# EAGLE design 7G_controller (EAGLE 6.4)
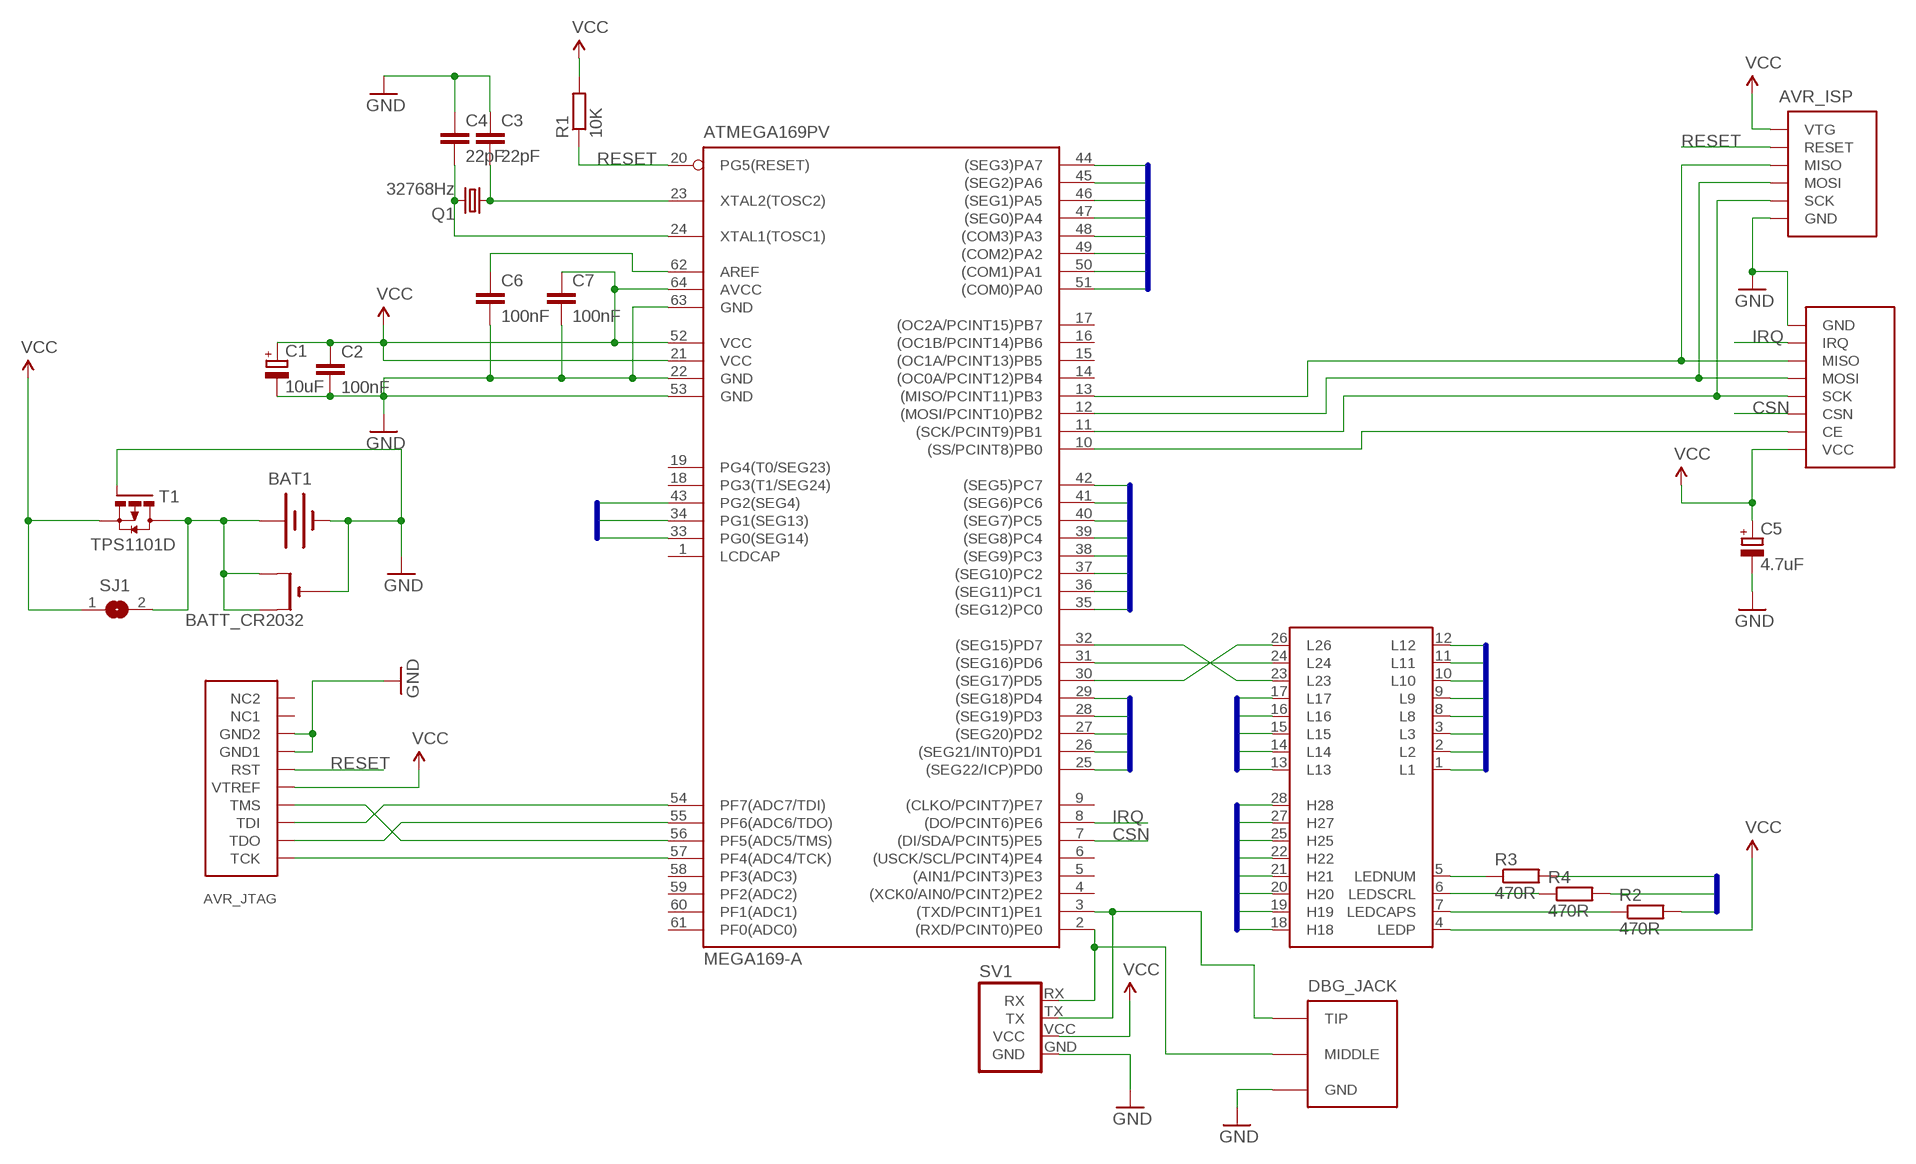
[diagram p0: schematic, sheet 1]

## Parts
ATMEGA169PV  MEGA169-A  [TQFP64]
AVR_ISP  AVR-ISP-6SMALL_FP  [AVR-ISP-6-SMALL-FP]
AVR_JTAG  AVR-JTAG  [AVR-JTAG]
BAT1  BATTERYPLAIN  [BATTERY]
BATT_CR2032  CR2032SMT  [CR2032-SMD]
C1  10uF  CPOL-EUSMCB  [SMC_B]
C2  100nF  C-EUC0805  [C0805]
C3  22pF  C-EUC0805  [C0805]
C4  22pF  C-EUC0805  [C0805]
C5  4.7uF  CPOL-EUSMCB  [SMC_B]
C6  100nF  C-EUC0805  [C0805]
C7  100nF  C-EUC0805  [C0805]
DBG_JACK  JACK_FEMALE_3.5MMCHEAP  [JACK_CHEAP]
MTRX_CONN  SS7G_CONNSMD  [SS7G_CONN_SMD]
NRF24L01  NRF24L01_MOD_NINE_EAGLESGENERIC  [NRF24L01_MOD_GENERIC]
Q1  32768Hz  CRYSTAL  [NSK_QUARTZ_CLOCK]
R1  10K  R-EU_R0805  [R0805]
R2  470R  R-EU_R0805  [R0805]
R3  470R  R-EU_R0805  [R0805]
R4  470R  R-EU_R0805  [R0805]
SJ1  SJ  [SJ]
SV1  UART_PORT  [UART_PORT]
T1  TPS1101D  [SO8]

## Nets
AREF: ATMEGA169PV.62(AREF) C6.1
CAPS: ATMEGA169PV.43(PG2(SEG4)) R2.2
CE: ATMEGA169PV.10((SS/PCINT8)PB0) NRF24L01.CE
CSN: ATMEGA169PV.7((DI/SDA/PCINT5)PE5) NRF24L01.CSN
GND: ATMEGA169PV.22(GND) ATMEGA169PV.53(GND) ATMEGA169PV.63(GND) AVR_ISP.GND AVR_JTAG.P$2(GND1) AVR_JTAG.P$10(GND2) BAT1.- BATT_CR2032.- C1.- C2.2 C3.1 C4.1 C5.- C6.2 C7.2 DBG_JACK.1(GND) NRF24L01.GND SV1.GND T1.4(G)
H18: ATMEGA169PV.42((SEG5)PC7) MTRX_CONN.18(H18)
H19: ATMEGA169PV.41((SEG6)PC6) MTRX_CONN.19(H19)
H20: ATMEGA169PV.40((SEG7)PC5) MTRX_CONN.20(H20)
H21: ATMEGA169PV.38((SEG9)PC3) MTRX_CONN.21(H21)
H22: ATMEGA169PV.36((SEG11)PC1) MTRX_CONN.22(H22)
H25: ATMEGA169PV.35((SEG12)PC0) MTRX_CONN.25(H25)
H27: ATMEGA169PV.37((SEG10)PC2) MTRX_CONN.27(H27)
H28: ATMEGA169PV.39((SEG8)PC4) MTRX_CONN.28(H28)
IRQ: ATMEGA169PV.8((DO/PCINT6)PE6) NRF24L01.IRQ
L1: ATMEGA169PV.50((COM1)PA1) MTRX_CONN.1(L1)
L2: ATMEGA169PV.48((COM3)PA3) MTRX_CONN.2(L2)
L3: ATMEGA169PV.46((SEG1)PA5) MTRX_CONN.3(L3)
L8: ATMEGA169PV.45((SEG2)PA6) MTRX_CONN.8(L8)
L9: ATMEGA169PV.44((SEG3)PA7) MTRX_CONN.9(L9)
L10: ATMEGA169PV.25((SEG22/ICP)PD0) MTRX_CONN.10(L10)
L11: ATMEGA169PV.26((SEG21/INT0)PD1) MTRX_CONN.11(L11)
L12: ATMEGA169PV.27((SEG20)PD2) MTRX_CONN.12(L12)
L13: ATMEGA169PV.28((SEG19)PD3) MTRX_CONN.13(L13)
L14: ATMEGA169PV.29((SEG18)PD4) MTRX_CONN.14(L14)
L15: ATMEGA169PV.51((COM0)PA0) MTRX_CONN.15(L15)
L16: ATMEGA169PV.49((COM2)PA2) MTRX_CONN.16(L16)
L17: ATMEGA169PV.47((SEG0)PA4) MTRX_CONN.17(L17)
LEDCAPS: MTRX_CONN.7(LEDCAPS) R2.1
LEDNUM: MTRX_CONN.6(LEDSCRL) R4.1
LEDSCRL: MTRX_CONN.5(LEDNUM) R3.1
MISO: ATMEGA169PV.13((MISO/PCINT11)PB3) AVR_ISP.MISO NRF24L01.MISO
MOSI: ATMEGA169PV.12((MOSI/PCINT10)PB2) AVR_ISP.MOSI NRF24L01.MOSI
N$2: ATMEGA169PV.32((SEG15)PD7) MTRX_CONN.23(L23)
N$4: BAT1.+ BATT_CR2032.+$1(+) BATT_CR2032.+$2(+1) SJ1.2 T1.5(D) T1.6(D) T1.7(D) T1.8(D)
N$6: ATMEGA169PV.23(XTAL2(TOSC2)) C3.2 Q1.1
N$8: ATMEGA169PV.24(XTAL1(TOSC1)) C4.2 Q1.4
N$20: ATMEGA169PV.30((SEG17)PD5) MTRX_CONN.26(L26)
N$21: ATMEGA169PV.31((SEG16)PD6) MTRX_CONN.24(L24)
N$29: ATMEGA169PV.2((RXD/PCINT0)PE0) DBG_JACK.4(MIDDLE) SV1.RX
N$30: ATMEGA169PV.3((TXD/PCINT1)PE1) DBG_JACK.2(TIP) DBG_JACK.3(TIP) SV1.TX
NUML: ATMEGA169PV.33(PG0(SEG14)) R3.2
RESET: ATMEGA169PV.20(PG5(RESET)) AVR_ISP.RESET AVR_JTAG.P$6(RST) R1.1
SCK: ATMEGA169PV.11((SCK/PCINT9)PB1) AVR_ISP.SCK NRF24L01.SCK
SCRL: ATMEGA169PV.34(PG1(SEG13)) R4.2
TCK: ATMEGA169PV.57(PF4(ADC4/TCK)) AVR_JTAG.P$1(TCK)
TDI: ATMEGA169PV.54(PF7(ADC7/TDI)) AVR_JTAG.P$9(TDI)
TDO: ATMEGA169PV.55(PF6(ADC6/TDO)) AVR_JTAG.P$3(TDO)
TMS: ATMEGA169PV.56(PF5(ADC5/TMS)) AVR_JTAG.P$5(TMS)
VCC: ATMEGA169PV.21(VCC) ATMEGA169PV.52(VCC) ATMEGA169PV.64(AVCC) AVR_ISP.VCC(VTG) AVR_JTAG.P$4(VTREF) C1.+ C2.1 C5.+ C7.1 MTRX_CONN.4(LEDP) NRF24L01.+3.3V(VCC) R1.2 SJ1.1 SV1.VCC T1.1(S) T1.2(S) T1.3(S)
Unconnected: ATMEGA169PV.1(LCDCAP) ATMEGA169PV.4((XCK0/AIN0/PCINT2)PE2) ATMEGA169PV.5((AIN1/PCINT3)PE3) ATMEGA169PV.6((USCK/SCL/PCINT4)PE4) ATMEGA169PV.9((CLKO/PCINT7)PE7) ATMEGA169PV.14((OC0A/PCINT12)PB4) ATMEGA169PV.15((OC1A/PCINT13)PB5) ATMEGA169PV.16((OC1B/PCINT14)PB6) ATMEGA169PV.17((OC2A/PCINT15)PB7) ATMEGA169PV.18(PG3(T1/SEG24)) ATMEGA169PV.19(PG4(T0/SEG23)) ATMEGA169PV.58(PF3(ADC3)) ATMEGA169PV.59(PF2(ADC2)) ATMEGA169PV.60(PF1(ADC1)) ATMEGA169PV.61(PF0(ADC0)) AVR_JTAG.P$7(NC1) AVR_JTAG.P$8(NC2)

## Buses
H28,H27,H25,H22,H21,H20,H19,H18
L1,L2,L3,L8,L9,L10,L11,L12,L13,L14,L15,L16,L17,L23,L24,L26
NUML,SCRL,CAPS

## Library data of the parts
ATMEGA169PV = KileParts:MEGA169: MICROCONTROLLER 16 Kbytes FLASH 1 Kbytes SRAM 512 bytes EEPROM USART 8-channel 10 bit ADC 4x25 Segment LCD Driver Source: avr.lbr; MPN: ATMEGA169PV-8AU; OC_FARNELL: 1617046; OC_NEWARK: 03P4011
AVR_ISP = KileParts:AVR-ISP-6: AVR ISP-6 Serial Programming Header
AVR_JTAG = KileParts:AVR-JTAG
BAT1 = KileParts:BATTERY: Battery Holders Various common sizes : AA, AAA, 20mm coin cell and 12mm coin cell.
BATT_CR2032 = KileParts:CR2032
C1 C5 = rcl:CPOL-EU: POLARIZED CAPACITOR, European symbol
C2-C4 C6 C7 = rcl:C-EU: CAPACITOR, European symbol
DBG_JACK = KileParts:JACK_FEMALE_3.5MM
MTRX_CONN = KileParts:SS7G_CONN: Connector for Steelseries 7G keyboard controller.
NRF24L01 = KileParts:NRF24L01_MOD_NINE_EAGLES
Q1 = KileParts:CRYSTAL: CRYSTAL
R1-R4 = rcl:R-EU_: RESISTOR, European symbol
SJ1 = jumper:SJ: SMD solder JUMPER
SV1 = KileParts:UART_PORT: PIN HEADER; OC_FARNELL: unknown; OC_NEWARK: unknown
T1 = KileParts:TPS1101D

## Board
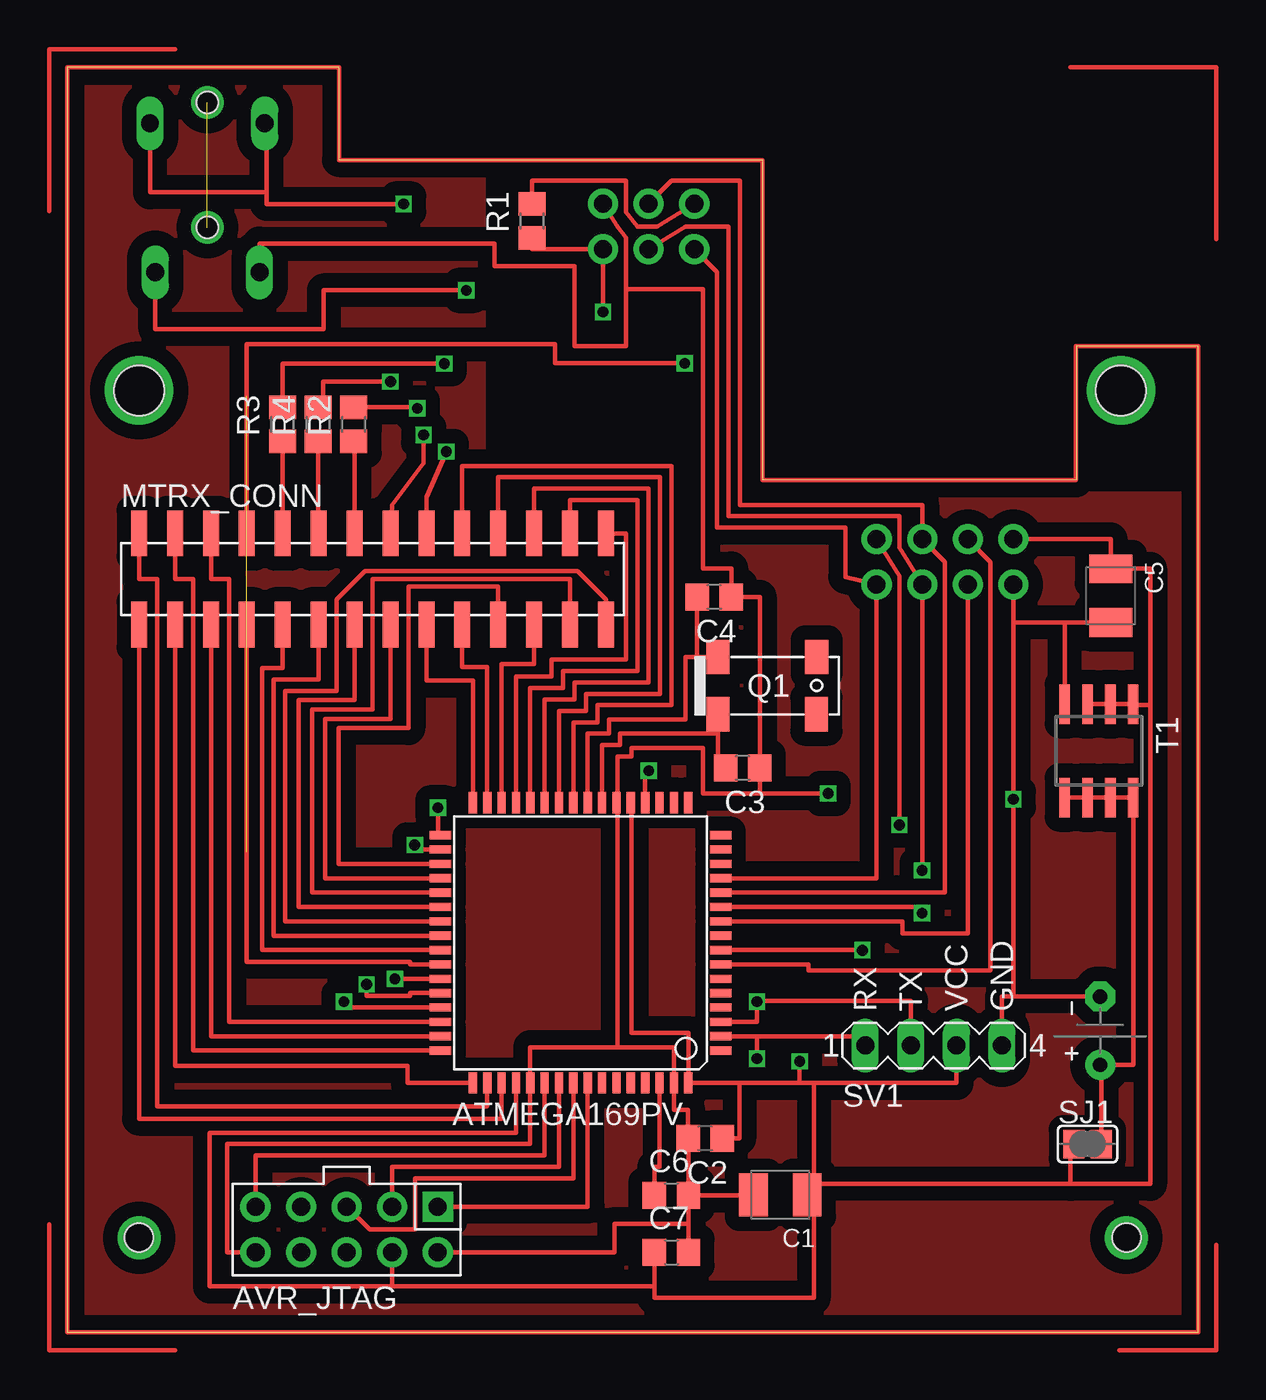
[diagram p1: board, top side]
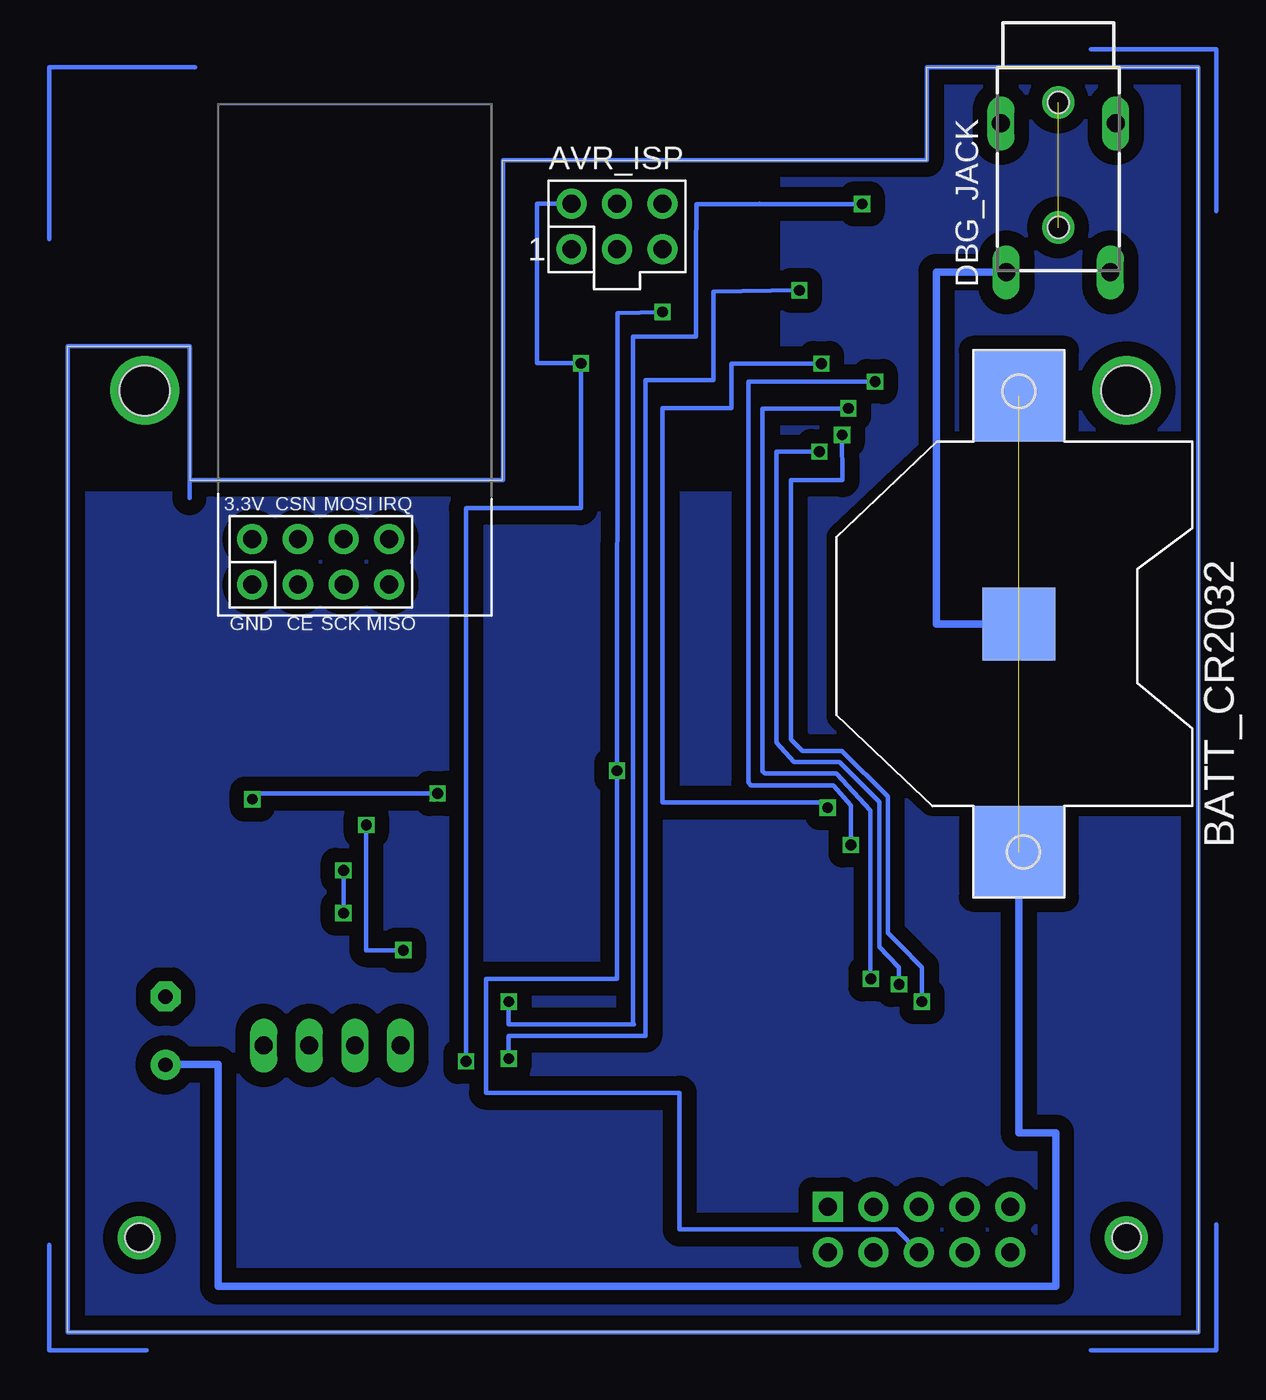
[diagram p2: board, bottom side, seen from below]

Size 63 x 70.46 mm. Coordinates in mm from the lower left corner, seen from the top.
Outline: 0,0 63,0 63,54.93 56.2,54.93 56.2,47.46 38.75,47.46 38.75,65.3 15.13,65.3 15.13,70.46 0,70.46 0,0
Copper layers (1*16): Top 0.035mm / dielectric 1.5mm / Bottom 0.035mm
Design rules "ITEADstudio_DRC": minimum track width 6mil, minimum drill 12mil, track to track 6mil, track to pad 6mil, pad to pad 6mil, via to via 6mil, smd to smd 0mil, copper to edge 10mil, drill to drill 10mil, minimum pad ring 10mil, minimum via ring 6mil, stop-mask expansion 2mil, vias tented up to drill 100mil, thermal gap 10mil
Holes 1.6 mm at 4,5.26 59,5.26
Holes 2.8 mm at 4,52.46 58.7,52.46

### Footprints (pad centres in the part's own frame; a part is rotated, then mirrored left to right if it is on the bottom)
TQFP64 = smd 1.194 x 0.457: 1 -7.8,6; 2 -7.8,5.2; 3 -7.8,4.4; 4 -7.8,3.6; 5 -7.8,2.8; 6 -7.8,2; 7 -7.8,1.2; 8 -7.8,0.4; 9 -7.8,-0.4; 10 -7.8,-1.2; 11 -7.8,-2; 12 -7.8,-2.8; 13 -7.8,-3.6; 14 -7.8,-4.4; 15 -7.8,-5.2; 16 -7.8,-6; 33 7.8,-6; 34 7.8,-5.2; 35 7.8,-4.4; 36 7.8,-3.6; 37 7.8,-2.8; 38 7.8,-2; 39 7.8,-1.2; 40 7.8,-0.4; 41 7.8,0.4; 42 7.8,1.2; 43 7.8,2; 44 7.8,2.8; 45 7.8,3.6; 46 7.8,4.4; 47 7.8,5.2; 48 7.8,6 | smd 0.457 x 1.194: 17 -6,-7.8; 18 -5.2,-7.8; 19 -4.4,-7.8; 20 -3.6,-7.8; 21 -2.8,-7.8; 22 -2,-7.8; 23 -1.2,-7.8; 24 -0.4,-7.8; 25 0.4,-7.8; 26 1.2,-7.8; 27 2,-7.8; 28 2.8,-7.8; 29 3.6,-7.8; 30 4.4,-7.8; 31 5.2,-7.8; 32 6,-7.8; 49 6,7.8; 50 5.2,7.8; 51 4.4,7.8; 52 3.6,7.8; 53 2.8,7.8; 54 2,7.8; 55 1.2,7.8; 56 0.4,7.8; 57 -0.4,7.8; 58 -1.2,7.8; 59 -2,7.8; 60 -2.8,7.8; 61 -3.6,7.8; 62 -4.4,7.8; 63 -5.2,7.8; 64 -6,7.8
AVR-ISP-6-SMALL-FP = drill 1 pad 1.676: GND 2.54,1.27; MISO -2.54,-1.27; MOSI 0,1.27; RESET 2.54,-1.27; SCK 0,-1.27; VCC -2.54,1.27
AVR-JTAG = drill 1 pad 1.676 square: P$1 -1.27,5.08 | drill 1 pad 1.676: P$2 1.27,5.08; P$3 -1.27,2.54; P$4 1.27,2.54; P$5 -1.27,0; P$6 1.27,0; P$7 -1.27,-2.54; P$8 1.27,-2.54; P$9 -1.27,-5.08; P$10 1.27,-5.08
BATTERY = drill 0.8 pad 1.676: + -1.905,0 | drill 0.8 pad 1.676 octagon: - 1.905,0
CR2032-SMD = smd 5.08 x 5.08: +$1 -12.7,0; +$2 12.7,0 | smd 4.064 x 4.064: - 0,0
SMC_B = smd 1.6 x 2.4: + -1.5,0; - 1.5,0
C0805 = smd 1.3 x 1.5: 1 -0.95,0; 2 0.95,0
JACK_CHEAP = drill 1 long: 1 -2.9,-8; 2 -3.2,0.3; 3 3.2,0.3; 4 2.9,-8 | hole 1.2: 0,1.46; 0,-5.5
SS7G_CONN_SMD = smd 0.89 x 2.54: 1 -13,2.54; 2 -11,2.54; 3 -9,2.54; 4 -7,2.54; 5 -5,2.54; 6 -3,2.54; 7 -1,2.54; 8 1,2.54; 9 3,2.54; 10 5,2.54; 11 7,2.54; 12 9,2.54; 13 11,2.54; 14 13,2.54; 15 -13,-2.54; 16 -11,-2.54; 17 -9,-2.54; 18 -7,-2.54; 19 -5,-2.54; 20 -3,-2.54; 21 -1,-2.54; 22 1,-2.54; 23 3,-2.54; 24 5,-2.54; 25 7,-2.54; 26 9,-2.54; 27 11,-2.54; 28 13,-2.54
NRF24L01_MOD_GENERIC = drill 1 pad 1.676: +3.3V 1.27,3.81; CE -1.27,1.27; CSN 1.27,1.27; GND -1.27,3.81; IRQ 1.27,-3.81; MISO -1.27,-3.81; MOSI 1.27,-1.27; SCK -1.27,-1.27
NSK_QUARTZ_CLOCK = smd 1.3 x 1.9: 1 -2.75,-1.6; 2 2.74,-1.6; 3 2.75,1.6; 4 -2.75,1.6
R0805 = smd 1.3 x 1.5: 1 -0.95,0; 2 0.95,0
SJ = smd 1.168 x 1.6: 1 -0.762,0; 2 0.762,0
UART_PORT = drill 1 long: GND 3.81,0; RX -3.81,0; TX -1.27,0; VCC 1.27,0
SO8 = smd 0.6 x 2.2: 1 -1.905,-2.6; 2 -0.635,-2.6; 3 0.635,-2.6; 4 1.905,-2.6; 5 1.905,2.6; 6 0.635,2.6; 7 -0.635,2.6; 8 -1.905,2.6

### Placement (x,y rotation side)
ATMEGA169PV  28.59,21.69 180 top
AVR_ISP  32.38,61.6 0 bottom
AVR_JTAG  15.56,5.72 270 top
BAT1  57.54,16.79 90 top
BATT_CR2032  10,39.46 270 bottom
C1  39.72,7.65 180 top
C2  35.54,10.8 180 top
C3  37.62,31.43 180 top
C4  36.04,40.96 180 top
C5  58.13,41.03 270 top
C6  33.66,7.62 0 top
C7  33.66,4.45 0 top
DBG_JACK  7.8,67.04 0 bottom
MTRX_CONN  17,41.96 0 top
NRF24L01  48.9,42.91 90 bottom
Q1  38.99,36.02 0 top
R1  25.88,61.9 90 top
R2  15.95,50.57 90 top
R3  11.98,50.57 90 top
R4  13.97,50.57 90 top
SJ1  56.83,10.48 0 top
SV1  48.26,15.97 0 top
T1  57.47,32.38 180 top

### Tracks (layer width: path | path; a pad name or v marks a point on that pad's centre or on a via)
AREF
  Top 0.254: ATMEGA169PV.62 32.99,9.21 32.7,9.21 | 32.7,9.21 | 32.7,9.21 C6.1
CAPS  (via drill 0.6)
  Top 0.254: v18.24,19.69 ATMEGA169PV.43 | R2.2 19.5,51.52 v19.5,51.46
  Bottom 0.254: v19.5,51.46 24.27,51.46 24.27,31.23 24.25,31.23 24.13,31.12 20.16,31.12 18.26,29.05 18.26,19.7 v18.24,19.69
CE
  Top 0.254: NRF24L01.CE 50.16,22.23 46.51,22.23 46.51,22.89 ATMEGA169PV.10
CSN
  Top 0.254: NRF24L01.CSN 51.44,42.91 51.44,20.16 41.27,20.16 41.27,20.48 ATMEGA169PV.7
DRILL1  (via drill 1.6)
  other vias: 4,5.26
DRILL2  (via drill 1.6)
  other vias: 59,5.26
DRILL3  (via drill 2.8)
  other vias: 58.7,52.46
DRILL4  (via drill 2.8)
  other vias: 4,52.46
GND  (via drill 0.6)
  Top 0.254: AVR_ISP.GND 30.64,61.6 31.11,60.96 31.11,58.1 | 31.11,58.1 35.4,58.1 35.4,42.55 36.99,42.55 C4.1 38.57,40.96 C3.1 38.57,30 | 30.64,15.88 33.79,15.88 ATMEGA169PV.63 33.79,12.38 34.59,12.38 C2.2 34.6,10.8 C6.2 | 30.64,15.88 25.79,15.88 ATMEGA169PV.53 25.79,10.48 8.89,10.48 8.89,4.45 AVR_JTAG.P$10 | BAT1.- 52.7,18.7 | ATMEGA169PV.22 30.64,29.48 | 30.64,29.48 30.64,15.88 | 30.64,29.48 30.64,32.07 31.43,32.07 31.43,32.54 35.4,32.54 35.4,30 38.57,30 | NRF24L01.GND 52.7,39.53 | 52.7,39.53 v52.7,29.69 52.7,18.7 | C5.- 55.56,39.53 | 55.56,39.53 52.7,39.53 | C6.2 34.6,6.03 | 34.6,6.03 C7.2 | C6.2 38.22,7.62 C1.- | v42.39,30 38.57,30 | 31.11,58.1 31.11,54.93 28.26,54.93 28.26,59.37 23.81,59.37 23.81,60.64 10.7,60.64 DBG_JACK.1 | AVR_JTAG.P$2 30.48,4.45 30.48,6.03 34.6,6.03 | T1.4 55.56,39.53 | 52.7,18.7 52.07,18.7 SV1.GND
  Bottom 0.254: v52.7,29.69 52.7,30 v42.39,30
  Bottom 0.406: DBG_JACK.1 14.61,59.04 14.61,39.46 BATT_CR2032.-
H18
  Top 0.254: MTRX_CONN.18 10,20.64 19.1,20.64 19.1,20.48 ATMEGA169PV.42
H19
  Top 0.254: MTRX_CONN.19 12,36.98 10.86,36.98 10.86,21.29 ATMEGA169PV.41
H20
  Top 0.254: MTRX_CONN.20 14,36.35 11.5,36.35 11.5,22.09 ATMEGA169PV.40
H21
  Top 0.254: MTRX_CONN.21 16,35.21 12.87,35.21 12.87,23.69 ATMEGA169PV.38
H22
  Top 0.254: MTRX_CONN.22 18,34.17 14.37,34.17 14.37,25.29 ATMEGA169PV.36
H25
  Top 0.254: MTRX_CONN.25 24,41.53 19,41.53 19,33.65 15.12,33.65 15.12,26.09 ATMEGA169PV.35
H27
  Top 0.254: ATMEGA169PV.37 13.62,24.48 13.62,34.69 17,34.69 17,41.96 28,41.96 MTRX_CONN.27
H28
  Top 0.254: ATMEGA169PV.39 12.12,22.89 12.12,35.73 15,35.73 15,40.8 16.59,42.39 28.41,42.39 30,40.8 MTRX_CONN.28
IRQ  (via drill 0.6)
  Top 0.254: NRF24L01.IRQ 46.35,42.12 v46.35,28.26 | v44.29,21.27 44.29,21.29 ATMEGA169PV.8
  Bottom 0.254: v46.35,28.26 46.35,21.27 v44.29,21.27
L1
  Top 0.254: MTRX_CONN.1 4,41.96 5,41.96 5,12.57 23.39,12.57 ATMEGA169PV.50
L2
  Top 0.254: MTRX_CONN.2 6,41.96 7,41.96 7,15.69 ATMEGA169PV.48
L3
  Top 0.254: MTRX_CONN.3 8,41.96 9,41.96 9,17.29 ATMEGA169PV.46
L8  (via drill 0.6)
  Top 0.254: MTRX_CONN.8 18.1,46.09 19.84,48.42 v19.84,49.98 | v15.4,18.41 15.4,18.09 ATMEGA169PV.45
  Bottom 0.254: v15.4,18.41 15.4,20.32 16.65,21.59 17.3,22.24 17.3,29.84 19.84,32.38 22.07,32.38 22.7,33.02 22.7,47.47 19.82,47.47 v19.84,49.98
L9  (via drill 0.6)
  Top 0.254: MTRX_CONN.9 20,46.51 v21.11,49.05 | ATMEGA169PV.44 19.1,18.89 19.1,18.73 16.67,18.73 v16.67,19.37
  Bottom 0.254: v16.67,19.37 16.67,20.32 17.29,20.96 17.78,21.45 17.78,29.53 20,31.75 22.54,31.75 23.5,32.86 23.5,49.05 v21.11,49.05
L10
  Top 0.254: MTRX_CONN.10 22,48.26 33.66,48.26 33.66,34.93 29.53,34.93 29.53,33.97 28.19,33.97 ATMEGA169PV.25
L11
  Top 0.254: MTRX_CONN.11 24,47.62 33.02,47.62 33.02,35.56 28.89,35.56 28.89,34.61 27.39,34.61 ATMEGA169PV.26
L12
  Top 0.254: MTRX_CONN.12 26,46.99 32.38,46.99 32.38,36.2 28.26,36.2 28.26,35.24 26.59,35.24 ATMEGA169PV.27
L13
  Top 0.254: MTRX_CONN.13 28,46.36 31.75,46.36 31.75,36.83 27.62,36.83 27.62,35.88 25.79,35.88 ATMEGA169PV.28
L14
  Top 0.254: MTRX_CONN.14 31.11,44.5 31.11,37.47 26.99,37.47 26.99,36.51 24.99,36.51 ATMEGA169PV.29
L15
  Top 0.254: MTRX_CONN.15 4,11.89 24.19,11.89 ATMEGA169PV.51
L16
  Top 0.254: MTRX_CONN.16 6,14.82 18.96,14.82 18.96,13.89 ATMEGA169PV.49
L17
  Top 0.254: MTRX_CONN.17 8,16.48 ATMEGA169PV.47
LEDCAPS
  Top 0.254: MTRX_CONN.7 16,48.92 R2.1
LEDNUM
  Top 0.254: R4.1 13.97,44.5 MTRX_CONN.6
LEDSCRL
  Top 0.254: R3.1 11.98,44.5 MTRX_CONN.5
MISO
  Top 0.254: AVR_ISP.MISO 36.2,59.05 36.2,44.81 43.34,44.81 43.34,42.07 NRF24L01.MISO 45.09,25.29 ATMEGA169PV.13
MOSI
  Top 0.254: AVR_ISP.MOSI 33.66,64.13 37.47,64.13 37.47,46.09 47.62,46.09 NRF24L01.MOSI 48.9,42.91 48.9,24.48 ATMEGA169PV.12
N$1
  Bottom 0.254: 56.2,47.46 38.73,47.46 38.73,65.3 15.13,65.3 15.13,70.46 0,70.46 0,0 63,0 63,54.93 56.2,54.93 56.2,46.46
N$2
  Top 0.254: MTRX_CONN.23 20,36.29 22.59,36.29 ATMEGA169PV.32
N$3
  Top 0.254: -1,62.46 -1,71.46 6,71.46
N$4  (1 unrouted)
  Top 0.254: SJ1.2 57.59,14.89 BAT1.+ 59.37,14.89 T1.8 T1.7 T1.6 T1.5
  Bottom 0.406: BATT_CR2032.+$2 10,11.11 7.94,11.11 7.94,2.54 54.61,2.54 54.61,14.92 57.54,14.92 BAT1.+
N$6
  Top 0.254: ATMEGA169PV.23 29.79,32.7 30.8,32.7 30.8,33.34 36.2,33.34 36.2,34.42 Q1.1 36.24,31.43 C3.2
N$8
  Top 0.254: ATMEGA169PV.24 28.99,33.34 30.16,33.34 30.16,34.13 34.45,34.13 34.45,37.62 35.09,37.62 | 35.09,37.62 Q1.4 | C4.2 35.09,37.62
N$10
  Top 0.254: -1,6 -1,-1 6,-1
N$11
  Top 0.254: 58.59,-1 64.01,-1 64.01,4.87
N$12
  Top 0.254: 55.88,70.46 64.01,70.46 64.01,60.88
N$13
  Bottom 0.254: -1,62.46 -1,71.46 6,71.46
N$16
  Bottom 0.254: -1,6 -1,-1 6,-1
N$17
  Bottom 0.254: 58.59,-1 64.01,-1 64.01,4.87
N$18
  Bottom 0.254: 55.88,70.46 64.01,70.46 64.01,60.88
N$19
  Top 0.254: 0,0 0,70.46 15.13,70.46 15.13,65.3 38.73,65.3 38.73,47.46 56.2,47.46 56.2,54.93 63,54.93 63,0 0,0
N$20
  Top 0.254: MTRX_CONN.26 26,37.21 24.19,37.21 ATMEGA169PV.30
N$21
  Top 0.254: MTRX_CONN.24 22,37.04 23.39,37.04 ATMEGA169PV.31
N$23
  pour Bottom (isolate 0.813): 0.64,0.63 62.55,0.63 62.55,46.72 23.18,46.72 23.18,64.77 14.61,64.77 14.61,69.9 0.64,69.9
N$24
  pour Top (isolate 0.813): 0.64,0.63 62.55,0.63 62.55,46.72 23.18,46.72 23.18,64.77 14.61,64.77 14.61,69.9 0.64,69.9
N$25  (via drill 1.2)  (1 unrouted)
  other vias: 7.8,68.5 7.8,61.54
N$29  (via drill 0.6)
  Top 0.254: ATMEGA169PV.2 38.42,16.48 | v38.42,15.24 38.42,16.48 | v22.23,58.04 14.29,58.04 14.29,55.88 4.9,55.88 DBG_JACK.4 | 38.42,16.48 44.45,16.48 SV1.RX
  Bottom 0.254: v22.23,58.04 27,57.96 27,53.04 30.81,53.04 30.81,16.51 38.42,16.51 v38.42,15.24
N$30  (via drill 0.6)
  Top 0.254: ATMEGA169PV.3 38.42,17.29 v38.42,18.41 38.42,18.46 47,18.46 SV1.TX | 11.11,63.5 4.6,63.5 DBG_JACK.3 | v18.73,62.85 11.11,62.85 11.11,63.5 | 11.11,63.5 11.11,66.34 DBG_JACK.2
  Bottom 0.254: v18.73,62.85 27.95,62.85 | 27.95,62.85 24.45,62.87 | 27.95,62.85 28,59.96 28,55.46 31.5,55.46 31.5,17.14 | 31.5,17.14 31.45,17.14 | 31.5,17.14 38.42,17.14 v38.42,18.41
NUML  (via drill 0.6)
  Top 0.254: v20.64,29.21 20.64,27.69 ATMEGA169PV.33 | R3.2 11.98,53.96 v21,53.96
  Bottom 0.254: v20.64,29.21 20.64,29.5 29.86,29.5 29.86,51.47 26,51.47 26,53.96 v21,53.97 v21,53.96
RESET  (via drill 0.6)
  Top 0.254: v32.38,31.27 32.19,31.27 ATMEGA169PV.20 | v29.84,56.83 AVR_ISP.RESET 25.88,60.33 R1.1
  Bottom 0.254: v29.84,56.83 32.34,56.77 v32.38,31.27 32.38,19.69 39.69,19.69 39.69,13.34 28.89,13.34 28.89,5.72 16.83,5.72 AVR_JTAG.P$6
SCK  (via drill 0.6)
  Top 0.254: AVR_ISP.SCK 34.45,61.6 36.83,61.6 36.83,45.46 46.35,45.46 46.35,43.7 NRF24L01.SCK v47.62,25.72 | v47.62,23.34 47.62,23.69 ATMEGA169PV.11
  Bottom 0.254: v47.62,25.72 v47.62,23.34
SCRL  (via drill 0.6)
  Top 0.254: v19.35,27.15 19.35,26.89 ATMEGA169PV.34 | R4.2 14.25,51.52 14.25,52.96 v18,52.96
  Bottom 0.254: v18,52.96 25.07,52.96 25.07,30.61 24.92,30.46 20.32,30.46 19.35,29.34 v19.35,27.15
TCK
  Top 0.254: ATMEGA169PV.57 28.99,6.99 AVR_JTAG.P$1
TDI
  Top 0.254: AVR_JTAG.P$9 10.48,9.84 26.59,9.84 ATMEGA169PV.54
TDO
  Top 0.254: AVR_JTAG.P$3 18.1,9.21 27.39,9.21 ATMEGA169PV.55
TMS
  Top 0.254: AVR_JTAG.P$5 16.83,5.72 19.37,5.72 19.37,8.57 28.19,8.57 ATMEGA169PV.56
VCC  (via drill 0.6)
  Top 0.254: R1.2 25.88,64.13 31.11,64.13 31.11,62.39 31.75,61.6 32.86,61.6 AVR_ISP.VCC | MTRX_CONN.4 10,55.04 27.18,55.04 27.18,53.98 v34.4,53.98 | 37.44,13.89 ATMEGA169PV.64 34.59,16.67 31.43,16.67 31.43,29.48 ATMEGA169PV.21 | NRF24L01.+3.3V 58.13,44.17 C5.+ 60.33,42.53 60.33,34.93 | 37.44,13.89 37.44,10.8 C2.1 | 41.59,13.89 41.59,8.25 | 41.59,8.25 41.59,7.62 | 41.59,7.62 41.59,1.91 32.7,1.91 32.7,2.54 | C1.+ 40.96,7.65 40.96,7.62 41.59,7.62 | 32.7,2.54 C7.1 | 37.44,13.89 40.8,13.89 | 40.8,13.89 v40.8,15.08 | 41.59,13.89 40.8,13.89 | AVR_JTAG.P$4 18.1,2.54 | 18.1,2.54 32.7,2.54 | ATMEGA169PV.52 24.99,11.11 7.94,11.11 7.94,2.54 18.1,2.54 | 55.88,8.25 55.88,10.48 SJ1.1 | T1.3 T1.2 T1.1 59.37,34.93 60.33,34.93 | 60.33,34.93 60.33,8.25 55.88,8.25 | 55.88,8.25 41.59,8.25 | 41.59,13.89 49.53,13.89 SV1.VCC
  Bottom 0.254: v40.8,15.08 40.8,45.91 34.4,45.91 v34.4,53.98 36.83,53.98 36.83,62.87 AVR_ISP.VCC